# Altium schematic sheet Top_View.SchDoc: Buck Converter 20V 60W
size A4; Date: 25 FEB 2024; Author: Arturo S. Bayangos; Revision: V1.0; SheetNumber: 1; SheetTotal: 4
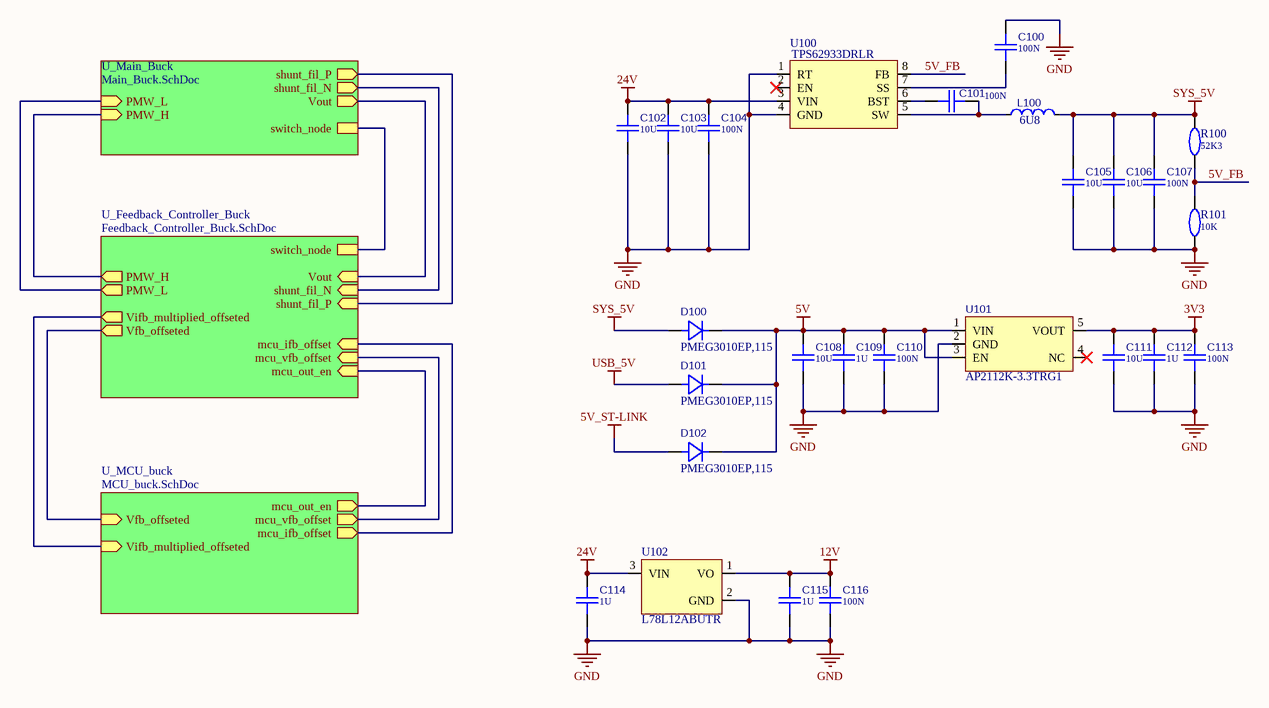
[diagram p0: Top_View.SchDoc]

## Parts
C100  value 100N  [CAP_0402]  (hidden comment: CAPACITOR)
C101  value 100N  [CAP_0402]  (hidden comment: CAPACITOR)
C102  value 10U  [CAP_1210]  (hidden comment: CAPACITOR)
C103  value 10U  [CAP_1210]  (hidden comment: CAPACITOR)
C104  value 100N  [CAP_0402]  (hidden comment: CAPACITOR)
C105  value 10U  [CAP_1210]  (hidden comment: CAPACITOR)
C106  value 10U  [CAP_1210]  (hidden comment: CAPACITOR)
C107  value 100N  [CAP_0402]  (hidden comment: CAPACITOR)
C108  value 10U  [CAP_1210]  (hidden comment: CAPACITOR)
C109  value 1U  [CAP_0603]  (hidden comment: CAPACITOR)
C110  value 100N  [CAP_0402]  (hidden comment: CAPACITOR)
C111  value 10U  [CAP_1210]  (hidden comment: CAPACITOR)
C112  value 1U  [CAP_0603]  (hidden comment: CAPACITOR)
C113  value 100N  [CAP_0402]  (hidden comment: CAPACITOR)
C114  value 1U  [CAP_0603]  (hidden comment: CAPACITOR)
C115  value 1U  [CAP_0603]  (hidden comment: CAPACITOR)
C116  value 100N  [CAP_0402]  (hidden comment: CAPACITOR)
D100  value PMEG3010EP,115  [SOD-128]  (hidden comment: DIODE)
D101  value PMEG3010EP,115  [SOD-128]  (hidden comment: DIODE)
D102  value PMEG3010EP,115  [SOD-128]  (hidden comment: DIODE)
L100  value 6U8  [IND_LQH3NPN6R8MMEL]  (hidden comment: INDUCTOR)
R100  value 52K3  [RES_0603]  (hidden comment: RESISTOR)
R101  value 10K  [RES_0603]  (hidden comment: RESISTOR)
U100  value TPS62933DRLR  [SOT-583]  (hidden comment: BUCK-CHIP_8P)
U101  value AP2112K-3.3TRG1  [SOT-23-5]  (hidden comment: LDO_5P)
U102  L78L12ABUTR  [SOT-98-3]

## Sub-sheets
U_Feedback_Controller_Buck = Feedback_Controller_Buck.SchDoc: shunt_fil_P (in), shunt_fil_N (in), PMW_H (out), PMW_L (out), Vout (in), mcu_ifb_offset (in), mcu_vfb_offset (in), mcu_out_en (in), Vifb_multiplied_offseted (out), Vfb_offseted (out), switch_node
U_Main_Buck = Main_Buck.SchDoc: shunt_fil_P (out), shunt_fil_N (out), PMW_H (in), PMW_L (in), Vout (out), switch_node
U_MCU_buck = MCU_buck.SchDoc: mcu_ifb_offset (out), mcu_vfb_offset (out), mcu_out_en (out), Vifb_multiplied_offseted (in), Vfb_offseted (in)

## Nets
3V3: C111.2 C112.2 C113.2 U101.5(VOUT)
5V: C108.2 C109.2 C110.2 D100.1 D101.1 D102.1 U101.1(VIN) U101.3(EN)
5V_ST-LINK: D102.2
12V: C115.2 C116.1 U102.1(VO)
24V: C102.2 C103.2 C104.2 C114.2 U100.3(VIN) U102.3(VIN)
GND: C100.2 C102.1 C103.1 C104.1 C105.1 C106.1 C107.1 C108.1 C109.1 C110.1 C111.1 C112.1 C113.1 C114.1 C115.1 C116.2 R101.1 U100.1(RT) U100.4(GND) U101.2(GND) U102.2(GND)
SYS_5V: C105.2 C106.2 C107.2 D100.2 L100.2 R100.2
USB_5V: D101.2
5V_FB: R100.1 R101.2 U100.8(FB)
NetC100_1: C100.1 U100.7(SS)
NetC101_1: C101.1 U100.6(BST)
NetC101_2: C101.2 L100.1 U100.5(SW)
(unnamed): sheet U_Main_Buck/shunt_fil_P, sheet U_Feedback_Controller_Buck/shunt_fil_P
(unnamed): sheet U_Main_Buck/shunt_fil_N, sheet U_Feedback_Controller_Buck/shunt_fil_N
(unnamed): sheet U_Main_Buck/PMW_H, sheet U_Feedback_Controller_Buck/PMW_H
(unnamed): sheet U_Main_Buck/PMW_L, sheet U_Feedback_Controller_Buck/PMW_L
(unnamed): sheet U_Main_Buck/Vout, sheet U_Feedback_Controller_Buck/Vout
(unnamed): sheet U_Main_Buck/switch_node, sheet U_Feedback_Controller_Buck/switch_node
(unnamed): sheet U_Feedback_Controller_Buck/mcu_ifb_offset, sheet U_MCU_buck/mcu_ifb_offset
(unnamed): sheet U_Feedback_Controller_Buck/mcu_vfb_offset, sheet U_MCU_buck/mcu_vfb_offset
(unnamed): sheet U_Feedback_Controller_Buck/mcu_out_en, sheet U_MCU_buck/mcu_out_en
(unnamed): sheet U_Feedback_Controller_Buck/Vifb_multiplied_offseted, sheet U_MCU_buck/Vifb_multiplied_offseted
(unnamed): sheet U_Feedback_Controller_Buck/Vfb_offseted, sheet U_MCU_buck/Vfb_offseted

Not connected (* = marked no-connect by the designer): U100 2(EN)*; U101 4(NC)*

## Notes on the sheet
- Title:
- Revision:
- Variant:
- Size:
- Author:
- A4
- ASB
- Date:
- Sheet:
- of

## Library data of the parts
C100 C101 C104 C107 C110 C113 C116 = UMK105B7104KV-FR: CAP 100N 0402 X7R 50V 10%; Manifacturer: Taiyo Yuden; Part Number: UMK105B7104KV-FR; ComponentLink1Description: Datasheet; ComponentLink1URL: https://datasheet.lcsc.com/lcsc/2211282030_Taiyo-Yuden-UMK105B7104KV-FR_C2167491.pdf; ComponentLink2Description: Characteristics; ComponentLink2URL: Datasheets\Capacitors\UMK105B7104KV-FR_TaiyoYuden.pdf; Package: 0402
C102 C103 C105 C106 C108 C111 = UMK325AB7106KM-T: CAP 10U 1210 X7R 50V 10%; Manifacturer: Taiyo Yuden; Part Number: UMK325AB7106KM-T; ComponentLink1Description: Datasheet; ComponentLink1URL: https://datasheet.lcsc.com/lcsc/2211282230_Taiyo-Yuden-UMK325AB7106KM-T_C386167.pdf; ComponentLink2Description: Characteristics; ComponentLink2URL: Datasheets\Capacitors\UMK325AB7106KM-T_TaiyoYuden_Char.pdf; Package: 1210
C109 C112 C114 C115 = TMK107AB7105KAHT: CAP 1U 0603 X7R 25V 10%; Manifacturer: Taiyo Yuden; Part Number: TMK107AB7105KAHT; ComponentLink1Description: Datasheet; ComponentLink1URL: https://datasheet.lcsc.com/lcsc/1912111437_Taiyo-Yuden-TMK107AB7105KAHT_C386079.pdf; ComponentLink2Description: Characteristics; ComponentLink2URL: Datasheets\Capacitors\TMK107AB7105KAHT_TaiyoYuden.pdf; Package: 0603
D100-D102 = PMEG3010EP,115: DIODE PMEG3010EP,115 SOD-128  Schottky 30V 1A; Forward voltage: 0.36V @ 1A; Manifacturer: Nexperia; Part Number: PMEG3010EP,115; Package: SOD-128; Type: Schottky; Current: 1A; Voltage: 30V; Operating temperature: 150 ℃; ComponentLink1Description: Datasheet; ComponentLink1URL: https://datasheet.lcsc.com/lcsc/2006101642_Nexperia-PMEG3010EP-115_C552865.pdf
L100 = LQH3NPN6R8MMEL: IND 6U8 SMD_W3mm_L3mm 0.9A 1.04A; Manifacturer: Murata Electronics; ComponentLink1Description: Datasheet; ComponentLink2Description: Characteristics; Part Number: LQH3NPN6R8MMEL; Irated: 0.9A; Isat: 1.04A; Package: SMD_W3mm_L3mm
R100 = ERA3AEB5232V: RES 52K3 0603 0.1% 0.1W 75V; Manifacturer: PANASONIC; Part Number: ERA3AEB5232V; ComponentLink1Description: Datasheet; ComponentLink1URL: https://datasheet.lcsc.com/lcsc/2005181233_PANASONIC-ERA3AEB5232V_C491140.pdf; ComponentLink2Description: Characteristics; Package: 0603
R101 = ARG03BTC1002: RES 10K 0603 0.1W 0.1% 75V; Manifacturer: Viking Tech; Part Number: ARG03BTC1002; ComponentLink1Description: Datasheet; ComponentLink1URL: Datasheets\Resistors\ARG03BTC1002_VikingTech.pdf; ComponentLink2Description: Characteristics; Package: 0603
U100 = TPS62933DRLR: IC TPS62933DRLR SOT-583 BUCK-CHIP; Supply Voltage: 3.8V-30V; Tj: 150 ℃; Manifacturer: Texas Instruments; Part Number: TPS62933DRLR; Package: SOT-583; Type: BUCK-CHIP; ComponentLink1Description: Datasheet; ComponentLink1URL: https://www.ti.com/lit/ds/symlink/tps62933p.pdf?ts=1658586703977&ref_url=https%253A%252F%252Fwww.ti.com%252Fproduct%252FTPS62933P%253Fjktype%253Dhomepageproduct; ComponentLink2Description: Characteristics
U101 = AP2112K-3.3TRG1: LDO AP2112K-3.3TRG1 SOT-25-5 3.3V 600mA; Dropout Voltage: 1.3V @ 600mA; Supply Voltage: 6.5V; Tj: 150 ℃; Manifacturer: Diodes Incorporated; Part Number: AP2112K-3.3TRG1; Package: SOT-25; Features: Current limiting, Thermal shutdown; Type: LDO; ComponentLink1Description: Datasheet; ComponentLink1URL: https://datasheet.lcsc.com/lcsc/2304140030_Diodes-Incorporated-AP2112K-3-3TRG1_C51118.pdf
U102 = L78L12ABUTR: LDO L78L12ABUTR SOT-89-3 12V 100mA; Dropout Voltage: 1.7V (typ); Supply Voltage: 35V; Tj: 125 ℃; Manifacturer: STMicroelectronics; Value: L78L12ABUTR; Part Number: L78L12ABUTR; Package: SOT-98-3; Features: Thermal overload, short circuit protection.; Type: LDO; ComponentLink1Description: Datasheet; ComponentLink1URL: https://datasheet.lcsc.com/lcsc/2011051905_STMicroelectronics-L78L12ABUTR_C915681.pdf